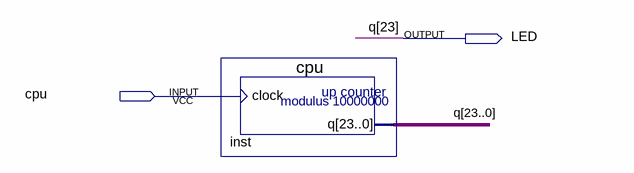
[diagram p0: schematic sheet]
// Quartus schematic TaskB.bdf as structural Verilog: 1 symbols, 2 pins
module TaskB (
  input  cpu,
  output LED
);

  wire [22:0] q;

  cpu inst (.clock(cpu), .q({LED, q}));

  // Other names for the same wires on the sheet: q[23] = LED
endmodule
